# EAGLE schematic opo iki (EAGLE 9.5.0)
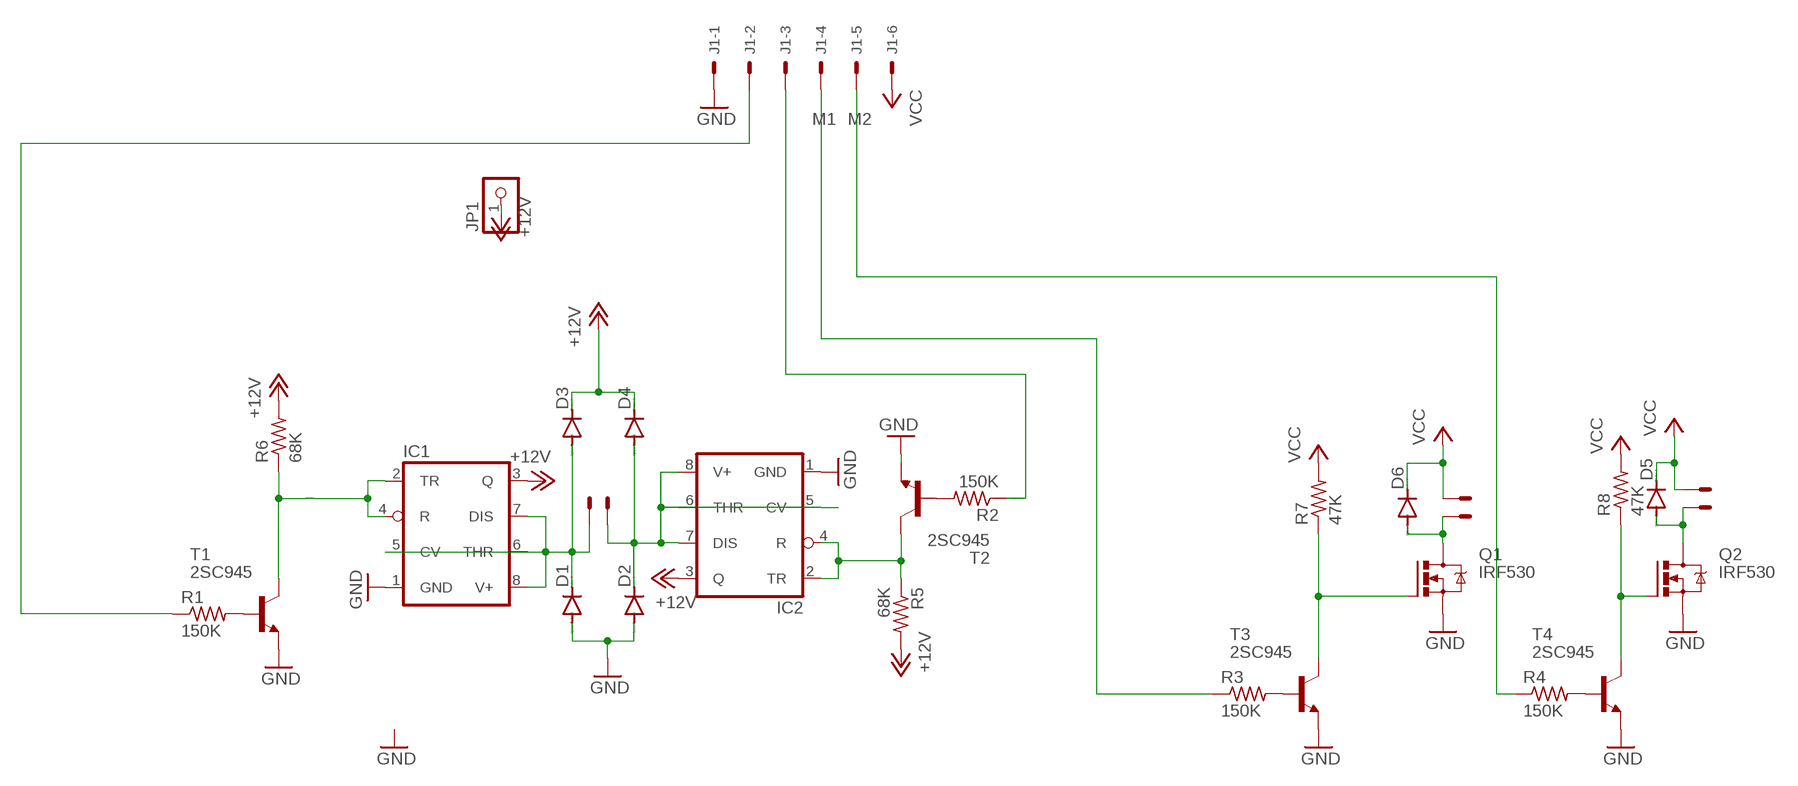
[diagram p0: schematic, sheet 1]

## Parts
D1  1N4004  [DO41-10]
D2  1N4004  [DO41-10]
D3  1N4004  [DO41-10]
D4  1N4004  [DO41-10]
D5  1N4004  [DO41-10]
D6  1N4004  [DO41-10]
IC1  LM555D  [SO08]
IC2  LM555D  [SO08]
J1  22-27-2061-06  [6410-06]
JP1  PINHD-1X1  [1X01]
Q1  IRF530  [TO220BV]
Q2  IRF530  [TO220BV]
R1  150K  R-US_0309/10  [0309/10]
R2  150K  R-US_0309/10  [0309/10]
R3  150K  R-US_0309/10  [0309/10]
R4  150K  R-US_0309/10  [0309/10]
R5  68K  R-US_0309/10  [0309/10]
R6  68K  R-US_0309/10  [0309/10]
R7  47K  R-US_0309/10  [0309/10]
R8  47K  R-US_0309/10  [0309/10]
T1  2SC945  [TO92-ECB]
T2  2SC945  [TO92-ECB]
T3  2SC945  [TO92-ECB]
T4  2SC945  [TO92-ECB]
X1  22-23-2021  [22-23-2021]
X2  22-23-2021  [22-23-2021]
X3  22-23-2021  [22-23-2021]

## Nets
+12V: D3.C D4.C IC1.3(Q) IC2.3(Q) JP1.1 R5.2 R6.2
GND: D1.A D2.A IC1.1(GND) IC2.1(GND) J1.1 Q1.S Q2.S T1.E T2.E T3.E T4.E
M1: J1.4 R3.1
M2: J1.5 R4.1
N$1: R1.2 T1.B
N$2: R2.2 T2.B
N$3: IC2.2(TR) IC2.4(R) R5.1 T2.C
N$4: IC1.2(TR) IC1.4(R) R6.1 T1.C
N$5: R3.2 T3.B
N$6: D1.C D3.A IC1.5(CV) IC1.6(THR) IC1.7(DIS) IC1.8(V+) X3.1
N$7: D2.C D4.A IC2.5(CV) IC2.6(THR) IC2.7(DIS) IC2.8(V+) X3.2
N$8: R4.2 T4.B
N$9: Q1.G R7.1 T3.C
N$10: Q2.G R8.1 T4.C
N$11: D6.A Q1.D X1.2
N$13: D5.A Q2.D X2.2
N$16: J1.2 R1.1
N$17: J1.3 R2.1
VCC: D5.C D6.C J1.6 R7.2 R8.2 X1.1 X2.1

## Library data of the parts
D1-D6 = diode:1N4004: DIODE general purpose rectifier, 1 A
IC1 IC2 = linear:*555: TIMER
J1 = con-molex:22-?-06: CONNECTOR wire to board 2.54 mm (.1 inch) pitch header; MF: MOLEX; OC_FARNELL: unknown; OC_NEWARK: unknown
JP1 = pinhead:PINHD-1X1: PIN HEADER
Q1 Q2 = transistor-power:IRF530: HEXFET Power MOSFET
R1-R8 = rcl:R-US_: RESISTOR, American symbol; SPICEPREFIX: R
T1-T4 = transistor:2SC945: NPN Silicon Epitaxial Planar Transistor Source: SEMTECH ELECTRONICS LTD. ... 2SC945 2.pdf
X1-X3 = con-molex:22-23-2021: .100" (2.54mm) Center Header - 2 Pin; MF: MOLEX; MPN: 22-23-2021; OC_FARNELL: 1462926; OC_NEWARK: 25C3832